# Altium schematic sheet 系统整体原理图.SchDoc
size A3
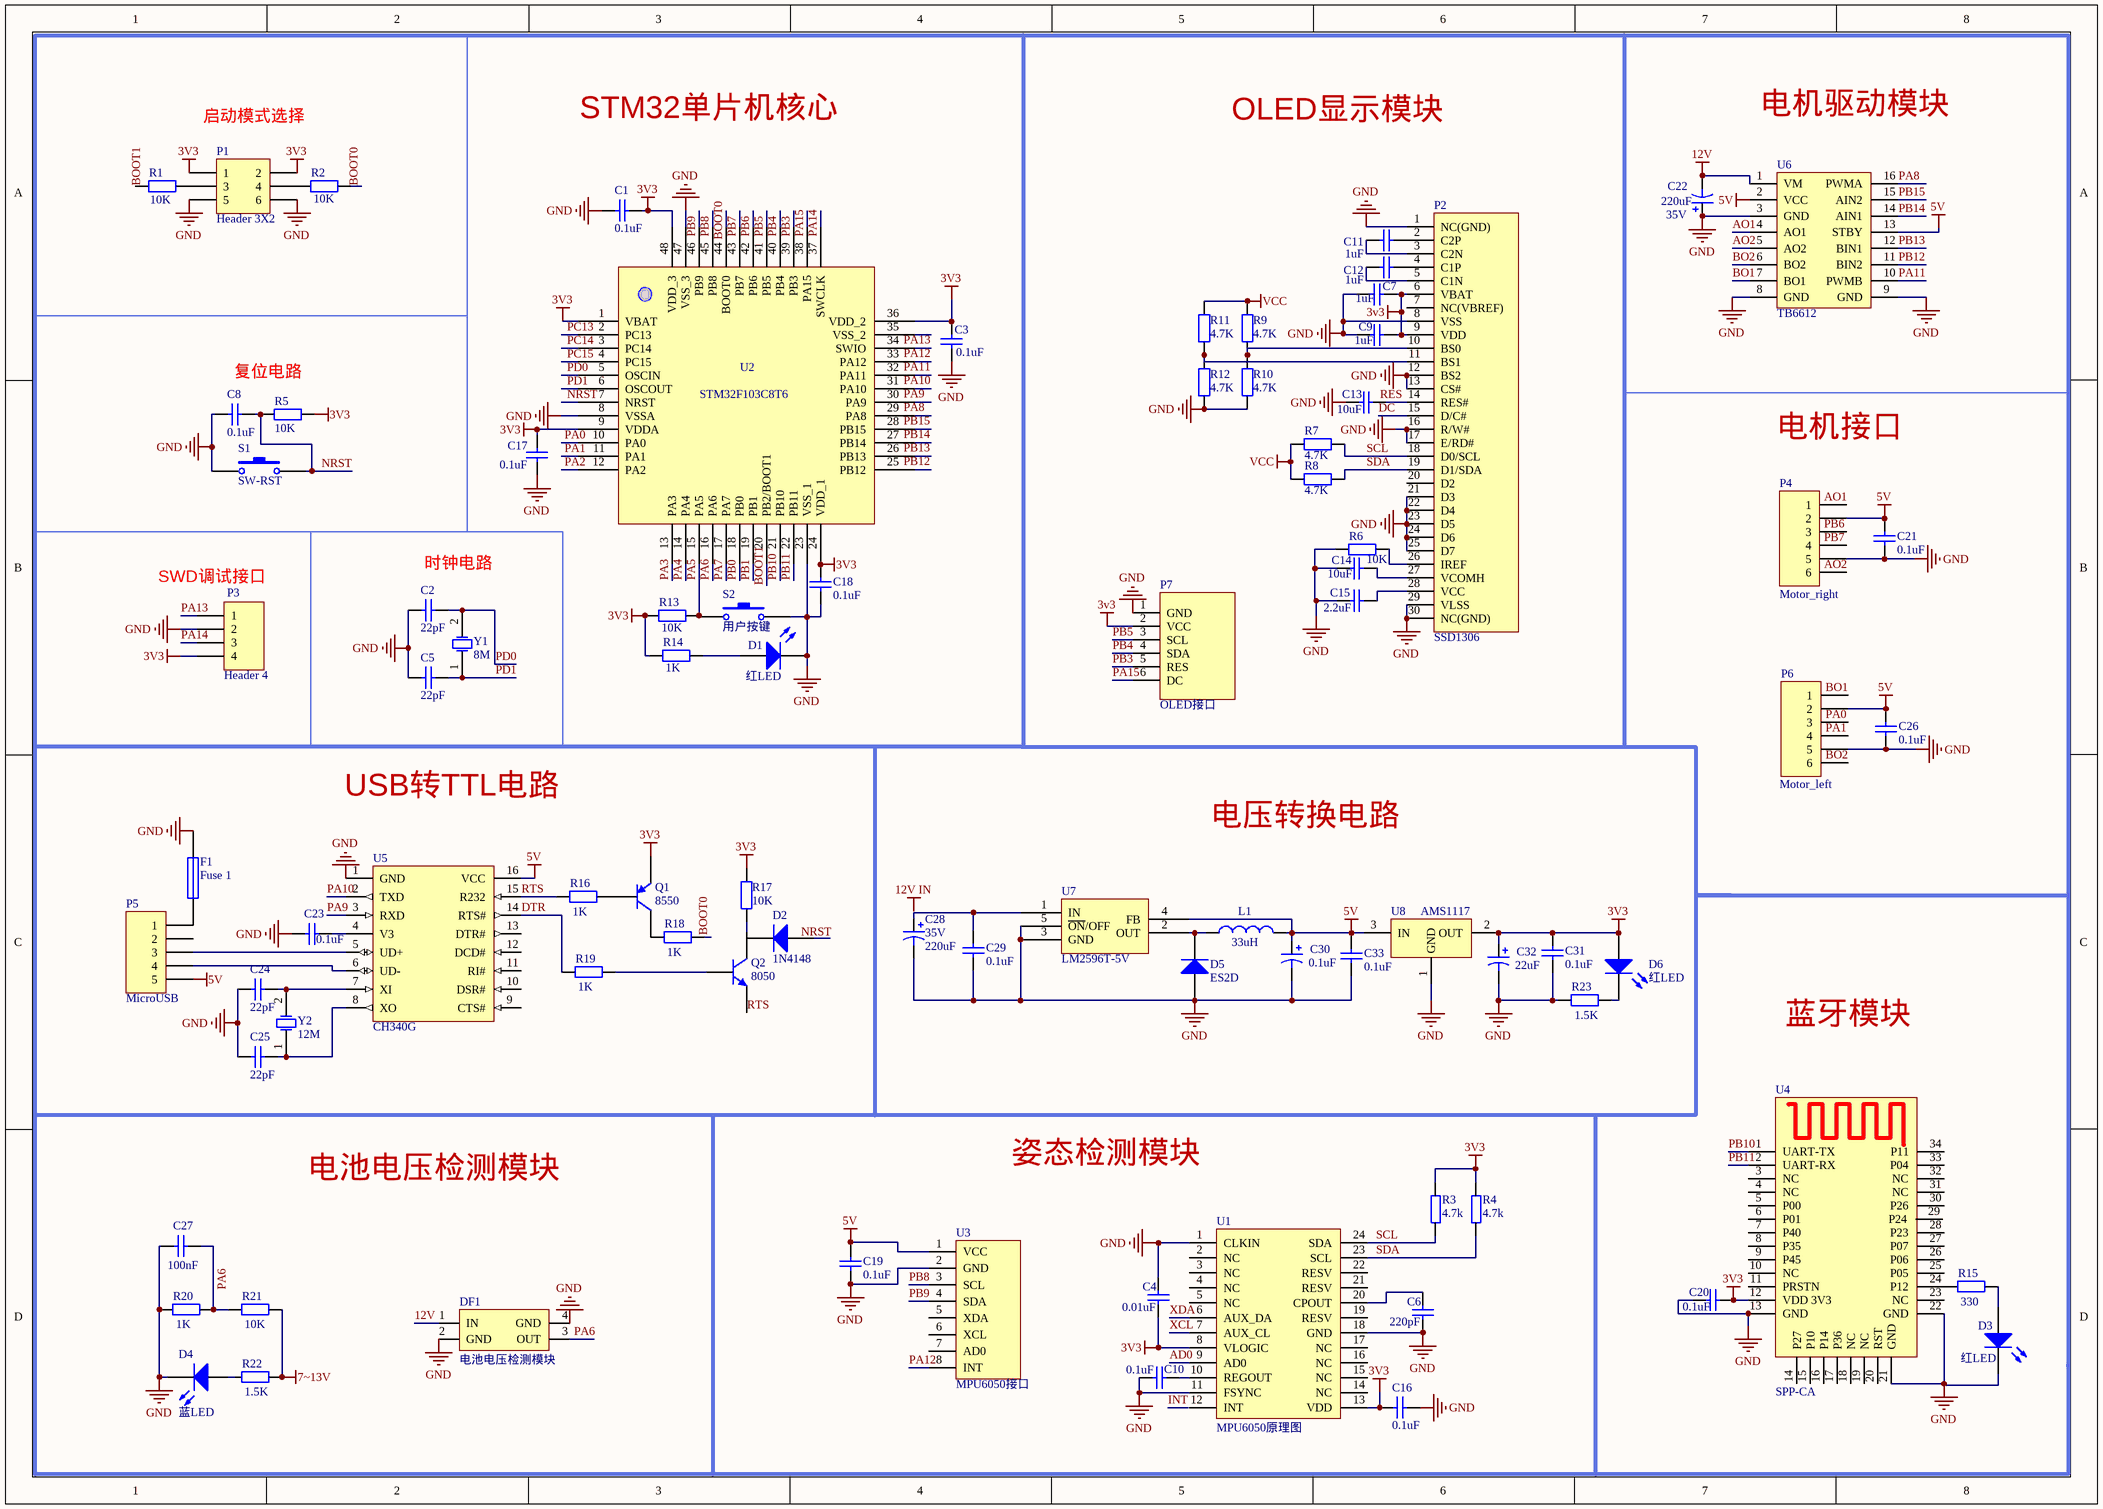
[diagram p0: 系统整体原理图.SchDoc]

## Parts
C1  value 0.1uF  [RAD-0.3]  (hidden comment: Cap)
C2  value 22pF  [RAD-0.3]  (hidden comment: Cap)
C3  value 0.1uF  [RAD-0.3]  (hidden comment: Cap)
C4  value 0.01uF  [RAD-0.3]  (hidden comment: Cap)
C5  value 22pF  [RAD-0.3]  (hidden comment: Cap)
C6  value 220pF  [RAD-0.3]  (hidden comment: Cap)
C7  value 1uF  [0603]
C8  value 0.1uF  [RAD-0.3]  (hidden comment: Cap)
C9  value 1uF  [0603]
C10  value 0.1uF  [RAD-0.3]  (hidden comment: Cap)
C11  value 1uF  [0603]
C12  value 1uF  [0603]
C13  value 10uF  [0603]
C14  value 10uF  [0603]
C15  value 2.2uF  [0603]
C16  value 0.1uF  [RAD-0.3]  (hidden comment: Cap)
C17  value 0.1uF  [RAD-0.3]  (hidden comment: Cap)
C18  value 0.1uF  [RAD-0.3]  (hidden comment: Cap)
C19  value 0.1uF  [RAD-0.3]  (hidden comment: Cap)
C20  value 0.1uF  [RAD-0.3]  (hidden comment: Cap)
C21  value 0.1uF  [RAD-0.3]  (hidden comment: Cap)
C22  35V  value 220uF  [C0805]
C23  value 0.1uF  [RAD-0.3]  (hidden comment: Cap)
C24  value 22pF  [RAD-0.3]  (hidden comment: Cap)
C25  value 22pF  [RAD-0.3]  (hidden comment: Cap)
C26  value 0.1uF  [RAD-0.3]  (hidden comment: Cap)
C27  value 100nF  [RAD-0.3]  (hidden comment: Cap)
C28  35V  value 220uF  [C0805]
C29  value 0.1uF  [RAD-0.3]  (hidden comment: Cap)
C30  value 0.1uF  [C0805]  (hidden comment: Cap Pol3)
C31  value 0.1uF  [RAD-0.3]  (hidden comment: Cap)
C32  value 22uF  [C0805]  (hidden comment: Cap Pol3)
C33  value 0.1uF  [RAD-0.3]  (hidden comment: Cap)
D1  红LED  [3.5X2.8X1.9]
D2  1N4148  [DO-35]
D3  红LED  [3.5X2.8X1.9]
D4  蓝LED  [3.5X2.8X1.9]
D5  ES2D  [DO-35]
D6  红LED  [3.5X2.8X1.9]
DF1  电池电压检测模块  [SOT-223]
F1  Fuse 1  [PIN-W2/E2.8]
L1  value 33uH  [0402-A]  (hidden comment: Inductor)
P1  Header 3X2  [HDR2X3]
P2  SSD1306  [OLED]
P3  Header 4  [HDR1X4]
P4  Motor_right  [HDR1X6]
P5  MicroUSB  [HDR1X5]
P6  Motor_left  [HDR1X6]
P7  OLED接口
Q1  8550  [SOT-23B_N]
Q2  8050  [SOT-23B_N]
R1  value 10K  [AXIAL-0.4]  (hidden comment: Res2)
R2  value 10K  [AXIAL-0.4]  (hidden comment: Res2)
R3  4.7k  [LC-0603_R]
R4  4.7k  [LC-0603_R]
R5  value 10K  [AXIAL-0.4]  (hidden comment: Res2)
R6  value 10K  [AXIAL-0.4]  (hidden comment: Res2)
R7  value 4.7K  [AXIAL-0.4]  (hidden comment: Res2)
R8  value 4.7K  [AXIAL-0.4]  (hidden comment: Res2)
R9  value 4.7K  [AXIAL-0.4]  (hidden comment: Res2)
R10  value 4.7K  [AXIAL-0.4]  (hidden comment: Res2)
R11  value 4.7K  [AXIAL-0.4]  (hidden comment: Res2)
R12  value 4.7K  [AXIAL-0.4]  (hidden comment: Res2)
R13  value 10K  [AXIAL-0.4]  (hidden comment: Res2)
R14  value 1K  [AXIAL-0.4]  (hidden comment: Res2)
R15  value 330  [AXIAL-0.4]  (hidden comment: Res2)
R16  value 1K  [AXIAL-0.4]  (hidden comment: Res2)
R17  value 10K  [AXIAL-0.4]  (hidden comment: Res2)
R18  value 1K  [AXIAL-0.4]  (hidden comment: Res2)
R19  value 1K  [AXIAL-0.4]  (hidden comment: Res2)
R20  value 1K  [AXIAL-0.4]  (hidden comment: Res2)
R21  value 10K  [AXIAL-0.4]  (hidden comment: Res2)
R22  value 1.5K  [AXIAL-0.4]  (hidden comment: Res2)
R23  value 1.5K  [AXIAL-0.4]  (hidden comment: Res2)
S1  SW-RST  [SPST-2]
S2  用户按键  [SPST-2]
U1  MPU6050原理图  [LC-QFN-24_4x4x05P]
U2  STM32F103C8T6  [TQFP48 7x7_L]
U3  MPU6050接口  [MPU6050]
U4  SPP-CA  [BLUETOOTH]
U5  CH340G  [SOP16]
U6  TB6612  [TB6612int]
U7  LM2596T-5V  [TO263-5]
U8  AMS1117  [SOT223]
Y1  8M  [R38]
Y2  12M  [R38]

## Nets
3V3: C1.2 C3.2 C4.1 C7.2 C9.2 C16.1 C17.2 C18.2 C20.1 C31.1 C32.1 D6.1(A) P1.1 P1.2 P2.6(VBAT) P2.9(VDD) P3.4 P7.2(VCC) Q1.3(E) R3.1 R4.1 R5.2 R13.1 R14.1 R17.1 U1.8(VLOGIC) U1.13(VDD) U2.1(VBAT) U2.9(VDDA) U2.24(VDD_1) U2.36(VDD_2) U2.48(VDD_3) U4.12(VDD_3V3) U8.2(OUT)
5V: C19.1 C21.2 C26.2 C30.1 C33.1 L1.2 P4.2 P5.5 P6.2 U3.1(VCC) U5.16(VCC) U6.2(VCC) U6.13(STBY) U7.4(FB) U8.3(IN)
7~13V: R21.2 R22.2
12V: C22.2 DF1.1(IN) U6.1(VM)
GND: C1.1 C2.1 C3.1 C4.2 C5.1 C6.1 C7.1 C8.1 C9.1 C10.1 C13.1 C14.1 C15.1 C16.2 C17.1 C18.1 C19.2 C20.2 C21.1 C22.1 C23.1 C24.1 C25.1 C26.1 C27.2 C28.2 C29.2 C30.2 C31.2 C32.2 C33.2 D1.2(K) D3.2(K) D4.2(K) D5.1(A) DF1.2(GND) DF1.4(GND) F1.2 P1.5 P1.6 P2.1(NC(GND)) P2.8(VSS) P2.12(BS2) P2.13(CS#) P2.16(R/W#) P2.17(E/RD#) P2.21(D3) P2.22(D4) P2.23(D5) P2.24(D6) P2.25(D7) P2.29(VLSS) P2.30(NC(GND)) P3.2 P4.5 P6.5 P7.1(GND) R6.2 R10.2 R12.2 R20.1 R23.1 S1.1 S2.2 U1.1(CLKIN) U1.11(FSYNC) U1.18(GND) U2.8(VSSA) U2.23(VSS_1) U2.47(VSS_3) U3.2(GND) U4.13(GND) U4.21(GND) U4.22(GND) U5.1(GND) U6.3(GND) U6.8(GND) U6.9(GND) U7.3(GND) U7.5(~{ON}/OFF) U8.1(GND)
VCC: R7.2 R8.2 R9.1 R11.1
AD0: U1.9(AD0)
AO1: U6.4(AO1)
AO2: U6.5(AO2)
BO1: U6.7(BO1)
BO2: U6.6(BO2)
BOOT0: R2.2
BOOT1: U2.20(PB2/BOOT1)
DC: P2.15(D/C#)
DTR: R19.1 U5.14(RTS#)
NRST: C8.2 R5.1 S1.2 U2.7(NRST)
PA0: U2.10(PA0)
PA1: U2.11(PA1)
PA2: U2.12(PA2)
PA3: U2.13(PA3)
PA4: U2.14(PA4)
PA5: R13.2 S2.1 U2.15(PA5)
PA6: C27.1 DF1.3(OUT) R20.2 R21.1 U2.16(PA6)
PA7: U2.17(PA7)
PA8: U6.16(PWMA)
PA9: U5.3(RXD)
PA10: U5.2(TXD)
PA11: U6.10(PWMB)
PA12: U3.8(INT)
PA13: P3.1
PA14: P3.3
PA15: P7.6(DC)
PB0: U2.18(PB0)
PB1: U2.19(PB1)
PB3: P7.5(RES)
PB4: P7.4(SDA)
PB5: P7.3(SCL)
PB8: U3.3(SCL)
PB9: U3.4(SDA)
PB10: U2.21(PB10) U4.1(UART-TX)
PB11: U2.22(PB11) U4.2(UART-RX)
PB12: U6.11(BIN2)
PB13: U6.12(BIN1)
PB14: U6.14(AIN1)
PB15: U6.15(AIN2)
PC13: U2.2(PC13)
PC14: U2.3(PC14)
PC15: U2.4(PC15)
PD0: C2.2 U2.5(OSCIN) Y1.2(OSC2)
PD1: C5.2 U2.6(OSCOUT) Y1.1(OSC1)
RTS: Q2.3(E) R16.1 U5.15(R232)
SCL: P2.18(D0/SCL) R3.2 R7.1 U1.24(SDA)
SDA: P2.19(D1/SDA) R4.2 R8.1 U1.23(SCL)
XCL: U1.7(AUX_CL)
XDA: U1.6(AUX_DA)
NetC6_2: C6.2 U1.20(CPOUT)
NetC10_2: C10.2 U1.10(REGOUT)
NetC11_1: C11.1 P2.3(C2N)
NetC11_2: C11.2 P2.2(C2P)
NetC12_1: C12.1 P2.5(C1N)
NetC12_2: C12.2 P2.4(C1P)
NetC13_2: C13.2 P2.14(RES#)
NetC14_2: C14.2 P2.27(VCOMH)
NetC15_2: C15.2 P2.28(VCC)
NetC23_2: C23.2 U5.4(V3)
NetC24_2: C24.2 U5.7(XI) Y2.2(OSC2)
NetC25_2: C25.2 U5.8(XO) Y2.1(OSC1)
NetC28_1: C28.1 C29.1 U7.1(IN)
NetD1_1: D1.1(A) R14.2
NetD3_1: D3.1(A) R15.2
NetD4_1: D4.1(A) R22.1
NetD5_2: D5.2(K) L1.1 U7.2(OUT)
NetD6_2: D6.2(K) R23.2
NetF1_1: F1.1 P5.1
NetP1_3: P1.3 R1.2
NetP1_4: P1.4 R2.1
NetP2_10: P2.10(BS0) R9.2 R10.1
NetP2_11: P2.11(BS1) R11.2 R12.1
NetP2_26: P2.26(IREF) R6.1
NetP5_3: P5.3 U5.5(UD+)
NetP5_4: P5.4 U5.6(UD-)
NetQ1_1: Q1.1(C) R18.1
NetQ1_2: Q1.2(B) R16.2
NetQ2_1: Q2.1(C) R17.2
NetQ2_2: Q2.2(B) R19.2
NetR15_1: R15.1 U4.24(P12)

Not connected (* = marked no-connect by the designer): D2 1(A) 2(K); P2 7(NC(VBREF)) 20(D2); P4 1 3 4 6; P5 2; P6 1 3 4 6; R1 1; R18 2; U1 2(NC) 3(NC) 4(NC) 5(NC) 12(INT) 14(NC) 15(NC) 16(NC) 17(NC) 19(RESV) 21(RESV) 22(RESV); U2 25(PB12) 26(PB13) 27(PB14) 28(PB15) 29(PA8) 30(PA9) 31(PA10) 32(PA11) 33(PA12) 34(SWIO) 35(VSS_2) 37(SWCLK) 38(PA15) 39(PB3) 40(PB4) 41(PB5) 42(PB6) 43(PB7) 44(BOOT0) 45(PB8) 46(PB9); U3 5(XDA) 6(XCL) 7(AD0); U4 3(NC) 4(NC) 5(P00) 6(P01) 7(P40) 8(P35) 9(P45) 10(NC) 11(PRSTN) 14(P27) 15(P10) 16(P14) 17(P36) 18(NC) 19(NC) 20(RST) 23(NC) 25(P05) 26(P06) 27(P07) 28(P23) 29(P24) 30(P26) 31(NC) 32(NC) 33(P04) 34(P11); U5 9(CTS#) 10(DSR#) 11(RI#) 12(DCD#) 13(DTR#)

## Notes on the sheet
- 启动模式选择
- STM32单片机核心
- OLED显示模块
- 电机驱动模块
- 复位电路
- 电机接口
- (near P3) SWD调试接口
- (near C2) 时钟电路
- USB转TTL电路
- 电压转换电路
- 蓝牙模块
- 电池电压检测模块
- 姿态检测模块
- Labels drawn without touching a wire or pin: 12V IN, AO1, AO2, BO1, BO2, BOOT0, BOOT1, NRST, PA0, PA1, PA8, PA9, PA10, PA11, PA12, PA13, PA14, PA15, PB3, PB4, PB5, PB6, PB7, PB8, PB9, PB12, PB13, PB14, PB15, RES

## Library data of the parts
C1-C21 C23-C27 C29 C31 C33 = Cap: Capacitor; Published: 8-Jun-2000; LatestRevisionDate: 17-Jul-2002; LatestRevisionNote: Re-released for DXP Platform.; PackageReference: RAD-0.3; Publisher: Altium Limited; PackageDescription: Radial Cap, Thru-Hole; 2 Leads; 0.3 in Pin Spacing
C22 C28 C30 C32 = Cap Pol3: Polarized Capacitor (Surface Mount); Published: 8-Jun-2000; LatestRevisionDate: 29-May-2009; LatestRevisionNote: IPC-7351 Footprint Added.; PackageReference: C0805; Publisher: Altium Limited; PackageDescription: Chip Capacitor
D1 D3 D4 D6 = LED3: Typical BLUE SiC LED; Published: 8-Jun-2000; LatestRevisionDate: 17-Dec-2003; LatestRevisionNote: PCB Footprint replaced.; DatasheetVersion: 16-Apr-2002; PackageVersion: 16-Apr-2002; PackageReference: 3.5X2.8X1.9; Publisher: Altium Limited; PackageDescription: SM LED; 2 C-Bend Leads; Body 3.5 x 2.8 x 1.9 mm, inc leads (LxWxH typ)
D2 D5 = Diode 1N4148: High Conductance Fast Diode; Published: 8-Jun-2000; LatestRevisionDate: 17-Jul-2002; LatestRevisionNote: Re-released for DXP Platform.; DatasheetVersion: 1997; PackageReference: DO-35; Publisher: Altium Limited; PackageDescription: Diode, Axial; Body 3.8 x 1.9 mm (LxDia. max), Lead Dia. 0.53 mm (max); Code_JEDEC: DO-204-AH; ComponentLink1Description: Manufacturer Link; ComponentLink1URL: http://www.fairchildsemi.com/; ComponentLink2Description: Datasheet; ComponentLink2URL: http://www.fairchildsemi.com/ds/1N%2F1N4148.pdf
F1 = Fuse 1: Fuse; Published: 8-Jun-2000; LatestRevisionDate: 17-Jul-2002; LatestRevisionNote: Re-released for DXP Platform.; PackageReference: PIN-W2/E2.8; Publisher: Altium Limited; PackageDescription: Thru-Hole; 2 Leads
L1 = Inductor: Code_IEC: 1005; Published: 8-Jun-2000; LatestRevisionDate: 29-May-2009; LatestRevisionNote: IPC-7351 Footprint Added.; PackageReference: 0402-A; Publisher: Altium Limited; PackageDescription: Chip Inductor; Code_JEITA: 0402
P1 = Header 3X2: Header, 3-Pin, Dual row; LatestRevisionDate: 17-Jul-2002; LatestRevisionNote: Re-released for DXP Platform.; Publisher: Altium Limited
P2 = SSD1306: OLED驱动芯片; LatestRevisionDate: 17-Jul-2002; LatestRevisionNote: Re-released for DXP Platform.; Publisher: Altium Limited
P3 = Header 4: Header, 4-Pin; LatestRevisionDate: 17-Jul-2002; LatestRevisionNote: Re-released for DXP Platform.; Publisher: Altium Limited
P4 P6 = Header 6: Header, 6-Pin; LatestRevisionDate: 17-Jul-2002; LatestRevisionNote: Re-released for DXP Platform.; Publisher: Altium Limited
P5 = Header 5: Header, 5-Pin; LatestRevisionDate: 17-Jul-2002; LatestRevisionNote: Re-released for DXP Platform.; Publisher: Altium Limited
Q1 = PNP: PNP Bipolar Transistor; Published: 8-Jun-2000; LatestRevisionDate: 29-May-2009; LatestRevisionNote: IPC-7351 Footprint Added.; PackageVersion: Aug-1999; PackageReference: SOT-23B; Publisher: Altium Limited; PackageDescription: 3-Pin SOT-23 Package 0.95 mm Pitch, 2.4 mm Lead Span
Q2 = QNPN: NPN Bipolar Transistor; Published: 8-Jun-2000; LatestRevisionDate: 29-May-2009; LatestRevisionNote: IPC-7351 Footprint Added.; PackageVersion: Aug-1999; PackageReference: SOT-23B; Publisher: Altium Limited; PackageDescription: 3-Pin SOT-23 Package 0.95 mm Pitch, 2.4 mm Lead Span
R1 R2 R5-R23 = Res2: Resistor; Published: 8-Jun-2000; LatestRevisionDate: 17-Jul-2002; LatestRevisionNote: Re-released for DXP Platform.; PackageReference: AXIAL-0.4; Publisher: Altium Limited; PackageDescription: Axial Device, Thru-Hole; 2 Leads; 0.4 in Pin Spacing
R3 R4 = R_1: value: 4.7K
S1 S2 = SW-PB: Switch; Published: 24-Mar-1999; LatestRevisionDate: 17-Jul-2002; LatestRevisionNote: Re-released for DXP Platform.; PackageReference: SPST-2; Publisher: Altium Limited; PackageDescription: Switch; 2 Leads
U1 = MPU6050原理图: 9轴运动处理传感器
U4 = BT04
U5 = CH340G: USB to TTL Serial / UART
U6 = TB6612int
U7 = LM2596
Y1 Y2 = XTAL: Crystal Oscillator; Published: 8-Jun-2000; LatestRevisionDate: 17-Jul-2002; LatestRevisionNote: Re-released for DXP Platform.; PackageReference: R38; Publisher: Altium Limited; PackageDescription: Crystal, Thru-Hole; 2 Leads; Body 3.1 x 8.2 mm (Dia.xH)